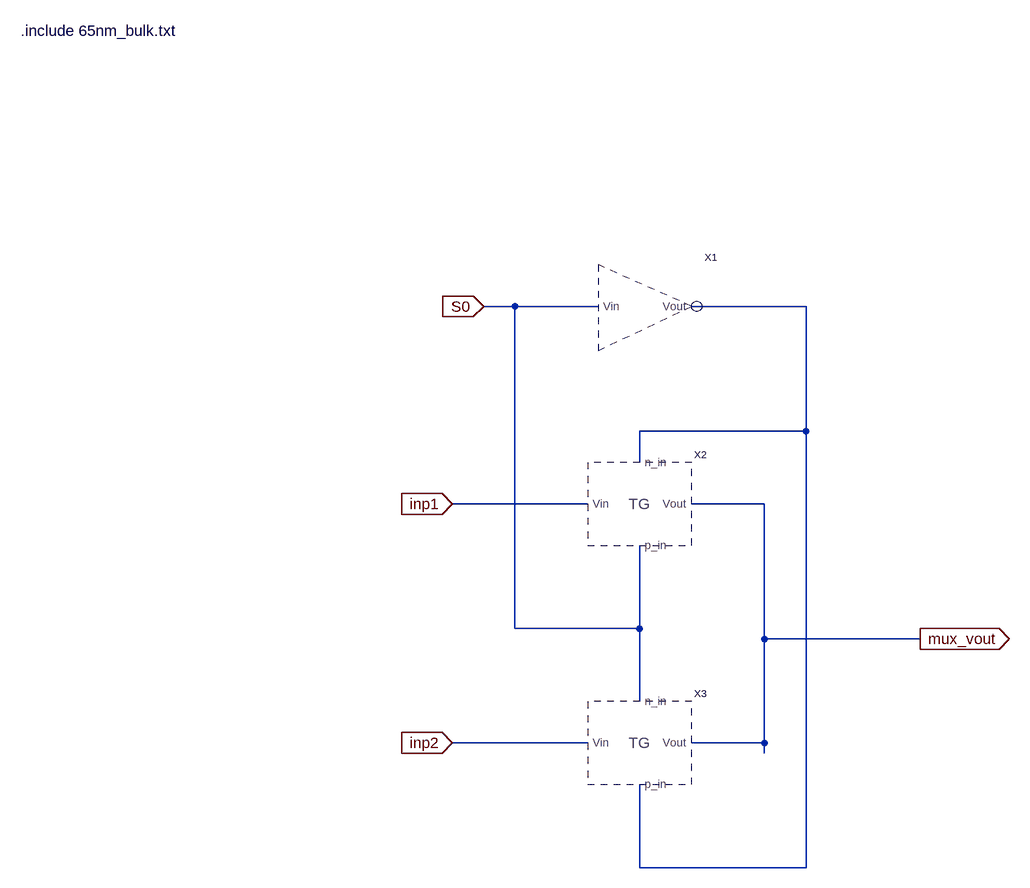
[diagram p0: schematic mux_analog.asc]
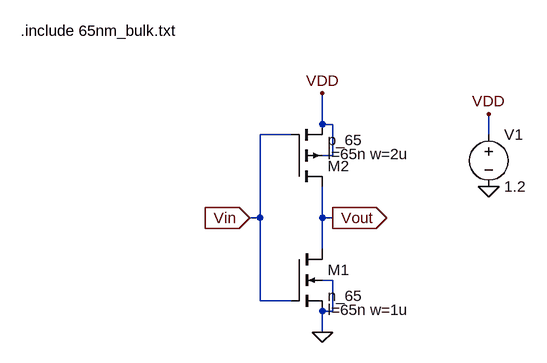
[diagram p1: sub-circuit inverter.asc]
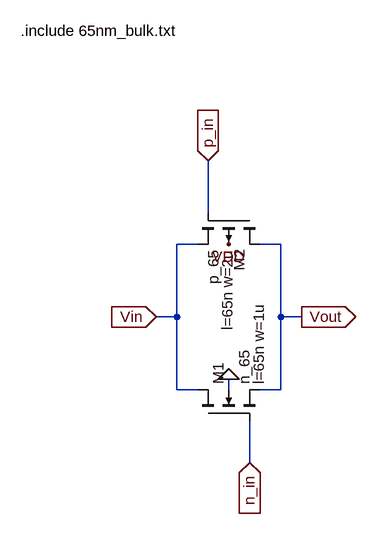
[diagram p2: sub-circuit transmission_gate.asc]
mux_analog.asc, the LTspice schematic file:
Version 4
SHEET 1 1676 1120
WIRE 352 -32 304 -32
WIRE 480 -32 352 -32
WIRE 800 -32 624 -32
WIRE 800 160 800 -32
WIRE 800 160 544 160
WIRE 544 208 544 160
WIRE 464 272 256 272
WIRE 736 272 624 272
WIRE 352 464 352 -32
WIRE 544 464 544 336
WIRE 544 464 352 464
WIRE 736 480 736 272
WIRE 976 480 736 480
WIRE 544 576 544 464
WIRE 464 640 256 640
WIRE 736 640 736 480
WIRE 736 640 624 640
WIRE 736 656 736 640
WIRE 544 832 544 704
WIRE 800 832 800 160
WIRE 800 832 544 832
FLAG 976 480 mux_vout
IOPIN 976 480 Out
FLAG 304 -32 S0
IOPIN 304 -32 In
FLAG 256 272 inp1
IOPIN 256 272 In
FLAG 256 640 inp2
IOPIN 256 640 In
SYMBOL inverter 544 -32 R0
SYMATTR InstName X1
SYMBOL transmission_gate 544 272 R0
SYMATTR InstName X2
SYMBOL transmission_gate 544 640 R0
SYMATTR InstName X3
TEXT -408 -456 Left 2 !.include 65nm_bulk.txt

inverter.asc, the sub-circuit schematic file:
Version 4
SHEET 1 880 680
WIRE 400 224 400 176
WIRE 416 224 400 224
WIRE 352 240 304 240
WIRE 656 240 656 208
WIRE 416 272 416 224
WIRE 416 272 400 272
WIRE 304 368 304 240
WIRE 304 368 288 368
WIRE 400 368 400 320
WIRE 416 368 400 368
WIRE 400 416 400 368
WIRE 416 464 400 464
WIRE 304 496 304 368
WIRE 352 496 304 496
WIRE 416 512 416 464
WIRE 416 512 400 512
WIRE 400 544 400 512
FLAG 400 544 0
FLAG 400 176 VDD
FLAG 656 208 VDD
FLAG 656 320 0
FLAG 288 368 Vin
IOPIN 288 368 In
FLAG 416 368 Vout
IOPIN 416 368 Out
SYMBOL nmos4 352 416 R0
WINDOW 123 56 94 Left 2
SYMATTR InstName M1
SYMATTR Value n_65
SYMATTR Value2 l=65n w=1u
SYMBOL pmos4 352 320 M180
WINDOW 123 56 50 Left 2
SYMATTR InstName M2
SYMATTR Value p_65
SYMATTR Value2 l=65n w=2u
SYMBOL Voltage 656 224 R0
SYMATTR InstName V1
SYMATTR Value 1.2
TEXT -64 80 Left 2 !.include 65nm_bulk.txt

transmission_gate.asc, the sub-circuit schematic file:
Version 4
SHEET 1 880 924
WIRE 64 368 64 288
WIRE 48 416 16 416
WIRE 176 416 144 416
WIRE 16 528 16 416
WIRE 16 528 -16 528
WIRE 176 528 176 416
WIRE 208 528 176 528
WIRE 16 640 16 528
WIRE 48 640 16 640
WIRE 96 640 96 624
WIRE 176 640 176 528
WIRE 176 640 144 640
WIRE 128 752 128 688
FLAG 96 624 0
FLAG 96 416 VDD
FLAG 128 752 n_in
IOPIN 128 752 In
FLAG 64 288 p_in
IOPIN 64 288 In
FLAG -16 528 Vin
IOPIN -16 528 In
FLAG 208 528 Vout
IOPIN 208 528 Out
SYMBOL nmos4 48 688 R270
WINDOW 123 56 94 Left 2
SYMATTR Value2 l=65n w=1u
SYMATTR InstName M1
SYMATTR Value n_65
SYMBOL pmos4 144 368 R90
WINDOW 123 56 50 Left 2
SYMATTR Value2 l=65n w=2u
SYMATTR InstName M2
SYMATTR Value p_65
TEXT -224 88 Left 2 !.include 65nm_bulk.txt

The netlist it stands for:
* mux_analog.asc
XX1 S0 N001 inverter
XX2 N001 S0 inp1 mux_vout transmission_gate
XX3 S0 N001 inp2 mux_vout transmission_gate

* block symbol definitions
.subckt inverter Vin Vout
M1 Vout Vin 0 0 n_65 l=65n w=1u
M2 Vout Vin VDD VDD p_65 l=65n w=2u
V1 VDD 0 1.2
.include 65nm_bulk.txt
.ends inverter

.subckt transmission_gate n_in p_in Vin Vout
M1 Vin n_in Vout 0 n_65 l=65n w=1u
M2 Vout p_in Vin VDD p_65 l=65n w=2u
.include 65nm_bulk.txt
.ends transmission_gate

.model NMOS NMOS
.model PMOS PMOS
.lib standard.mos
.include 65nm_bulk.txt
.backanno
.end